# Altium schematic sheet MR26_GSS_0.SchDoc
size 363 x 297 mm; Origin: Eagle; OriginPath: C:\Users\David Nguyen\Downloads\eagle\eagle\MR26_GSS.sch; OriginSheet: 1; OriginDescription: 02 Power input, protection & 5V0
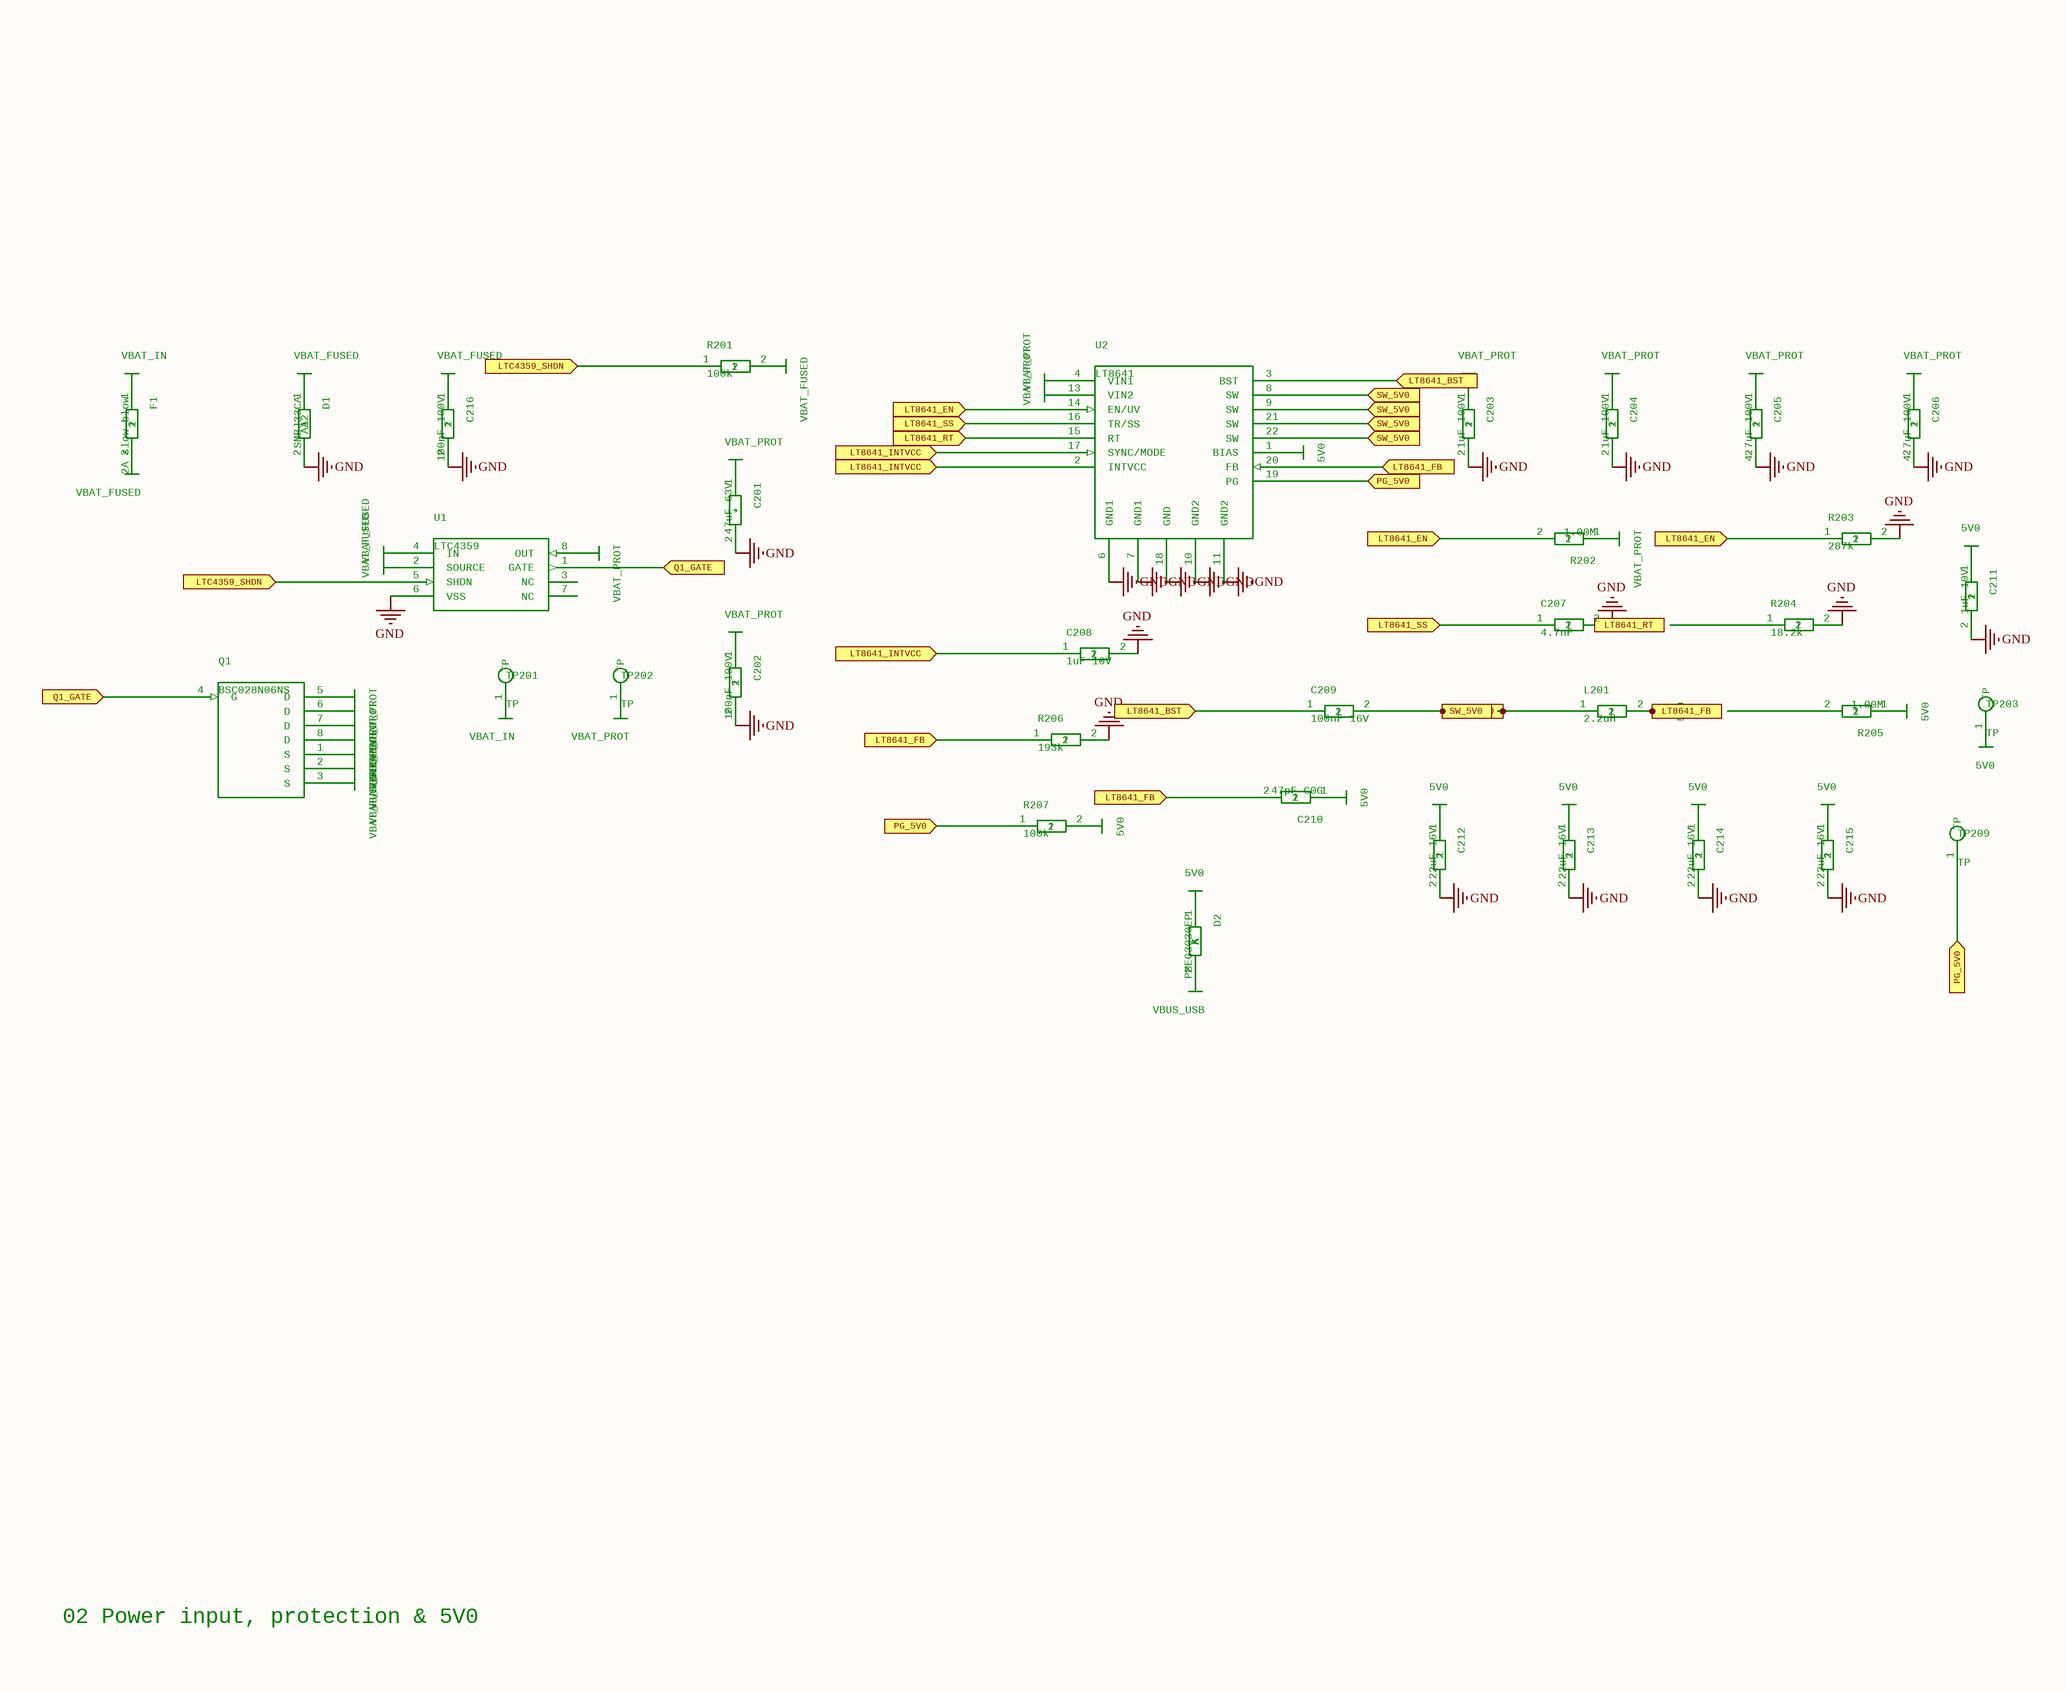
[diagram p0: MR26_GSS_0.SchDoc]

## Parts
C201  47uF 63V  [C_CP_Elec_8x10]
C202  100nF 100V  [C_0603]
C203  1uF 100V  [C_0805]
C204  1uF 100V  [C_0805]
C205  4.7uF 100V  [C_1210]
C206  4.7uF 100V  [C_1210]
C207  4.7nF  [C_0402]
C208  1uF 10V  [C_0402]
C209  100nF 16V  [C_0402]
C210  47pF C0G  [C_0402]
C211  1uF 10V  [C_0402]
C212  22uF 16V  [C_1210]
C213  22uF 16V  [C_1210]
C214  22uF 16V  [C_1210]
C215  22uF 16V  [C_1210]
C216  100nF 100V  [C_0603]
D1  SMBJ33CA  [D_SMB]
D2  PMEG3030EP  [D_SOD-128]
F1  2A slow-blow  [Fuse_Nano2_452]
L201  2.2uH  [L_XEL4030]
PWR0001  VBAT_IN
PWR0002  VBAT_FUSED
PWR0003  VBAT_FUSED
PWR0005  VBAT_FUSED
PWR0007  VBAT_FUSED
PWR0008  VBAT_FUSED
PWR0010  VBAT_PROT
PWR0011  VBAT_FUSED
PWR0012  VBAT_PROT
PWR0013  VBAT_PROT
PWR0014  VBAT_PROT
PWR0015  VBAT_PROT
PWR0016  VBAT_FUSED
PWR0017  VBAT_FUSED
PWR0018  VBAT_FUSED
PWR0019  VBAT_PROT
PWR0021  VBAT_PROT
PWR0023  VBAT_IN
PWR0024  VBAT_PROT
PWR0025  VBAT_PROT
PWR0026  VBAT_PROT
PWR0027  5V0
PWR0033  VBAT_PROT
PWR0035  VBAT_PROT
PWR0037  VBAT_PROT
PWR0039  VBAT_PROT
PWR0041  VBAT_PROT
PWR0046  5V0
PWR0047  5V0
PWR0049  5V0
PWR0050  5V0
PWR0052  5V0
PWR0054  5V0
PWR0056  5V0
PWR0058  5V0
PWR0060  5V0
PWR0061  5V0
PWR0062  VBUS_USB
PWR0063  5V0
Q1  BSC028N06NS  [PG-TDSON-8]
R201  100k  [R_0402]
R202  1.00M  [R_0402]
R203  287k  [R_0402]
R204  18.2k  [R_0402]
R205  1.00M  [R_0402]
R206  193k  [R_0402]
R207  100k  [R_0402]
TP201  TP  [TP_1.0mm]
TP202  TP  [TP_1.0mm]
TP203  TP  [TP_1.0mm]
TP209  TP  [TP_1.0mm]
U1  LTC4359  [MSOP-8]
U2  LT8641  [QFN-18_3x4_UDC]

## Ports
LT8641_BST (in), LT8641_EN (in), LT8641_FB (in), LT8641_INTVCC (in), LT8641_RT (in), LT8641_SS (in), LTC4359_SHDN (in), PG_5V0 (in), Q1_GATE (in), SW_5V0 (in)

## Nets
GND: C201.2(-) C202.2 C203.2 C204.2 C205.2 C206.2 C207.2 C208.2 C211.2 C212.2 C213.2 C214.2 C215.2 C216.2 D1.2(A2) R203.2 R204.2 R206.2 U1.6(VSS) U2.6(GND1) U2.7(GND1) U2.10(GND2) U2.11(GND2) U2.18(GND)
LT8641_BST: C209.1 U2.3(BST) ; port LT8641_BST
LT8641_EN: R202.2 R203.1 U2.14(EN/UV) ; port LT8641_EN
LT8641_FB: C210.2 L201.2 PWR0046.?1(5V0) R206.1 U2.20(FB) ; port LT8641_FB
LT8641_INTVCC: C208.1 U2.2(INTVCC) U2.17(SYNC/MODE) ; port LT8641_INTVCC
LT8641_RT: U2.15(RT) ; port LT8641_RT
LT8641_SS: C207.1 U2.16(TR/SS) ; port LT8641_SS
LTC4359_SHDN: R201.1 U1.5(SHDN) ; port LTC4359_SHDN
PG_5V0: R207.1 TP209.1(TP) U2.19(PG) ; port PG_5V0
Q1_GATE: Q1.4(G) U1.1(GATE) ; port Q1_GATE
SW_5V0: C209.2 L201.1 U2.8(SW) U2.9(SW) U2.21(SW) U2.22(SW) ; port SW_5V0
NetC201_1: C201.1(+) PWR0019.?1(VBAT_PROT)
NetC202_1: C202.1 PWR0021.?1(VBAT_PROT)
NetC203_1: C203.1 PWR0033.?1(VBAT_PROT)
NetC204_1: C204.1 PWR0035.?1(VBAT_PROT)
NetC205_1: C205.1 PWR0037.?1(VBAT_PROT)
NetC206_1: C206.1 PWR0039.?1(VBAT_PROT)
NetC210_1: C210.1 PWR0049.?1(5V0)
NetC211_1: C211.1 PWR0050.?1(5V0)
NetC212_1: C212.1 PWR0052.?1(5V0)
NetC213_1: C213.1 PWR0054.?1(5V0)
NetC214_1: C214.1 PWR0056.?1(5V0)
NetC215_1: C215.1 PWR0058.?1(5V0)
NetC216_1: C216.1 PWR0005.?1(VBAT_FUSED)
NetD1_1: D1.1(A1) PWR0003.?1(VBAT_FUSED)
NetD2_1: D2.1(K) PWR0061.?1(5V0)
NetD2_2: D2.2(A) PWR0062.?1(VBUS_USB)
NetF1_1: F1.1 PWR0001.?1(VBAT_IN)
NetF1_2: F1.2 PWR0002.?1(VBAT_FUSED)
NetPWR0007_?1: PWR0007.?1(VBAT_FUSED) U1.4(IN)
NetPWR0008_?1: PWR0008.?1(VBAT_FUSED) U1.2(SOURCE)
NetPWR0010_?1: PWR0010.?1(VBAT_PROT) U1.8(OUT)
NetPWR0011_?1: PWR0011.?1(VBAT_FUSED) R201.2
NetPWR0012_?1: PWR0012.?1(VBAT_PROT) Q1.5(D)
NetPWR0013_?1: PWR0013.?1(VBAT_PROT) Q1.6(D)
NetPWR0014_?1: PWR0014.?1(VBAT_PROT) Q1.7(D)
NetPWR0015_?1: PWR0015.?1(VBAT_PROT) Q1.8(D)
NetPWR0016_?1: PWR0016.?1(VBAT_FUSED) Q1.1(S)
NetPWR0017_?1: PWR0017.?1(VBAT_FUSED) Q1.2(S)
NetPWR0018_?1: PWR0018.?1(VBAT_FUSED) Q1.3(S)
NetPWR0023_?1: PWR0023.?1(VBAT_IN) TP201.1(TP)
NetPWR0024_?1: PWR0024.?1(VBAT_PROT) TP202.1(TP)
NetPWR0025_?1: PWR0025.?1(VBAT_PROT) U2.4(VIN1)
NetPWR0026_?1: PWR0026.?1(VBAT_PROT) U2.13(VIN2)
NetPWR0027_?1: PWR0027.?1(5V0) U2.1(BIAS)
NetPWR0041_?1: PWR0041.?1(VBAT_PROT) R202.1
NetPWR0047_?1: PWR0047.?1(5V0) R205.1
NetPWR0060_?1: PWR0060.?1(5V0) R207.2
NetPWR0063_?1: PWR0063.?1(5V0) TP203.1(TP)

Not connected (* = marked no-connect by the designer): R204 1; R205 2; U1 3(NC) 7(NC)

## Notes on the sheet
- 02 Power input, protection & 5V0

## Library data of the parts
C201 = CAP_POLC_CP_Elec_8x10: MPN: Panasonic EEH-ZC1J470P; GateName_1: G$1; SymbolName_1: CAP_POL; DeviceName: C_CP_Elec_8x10; LibraryName: MR26; DeviceSetName: CAP_POL
C202 C216 = CAPC_0603: MPN: CAP 100nF 100V 0603; GateName_1: G$1; SymbolName_1: CAP; DeviceName: C_0603; LibraryName: MR26; DeviceSetName: CAP
C203 C204 = CAPC_0805: MPN: CAP 1uF 100V 0805; GateName_1: G$1; SymbolName_1: CAP; DeviceName: C_0805; LibraryName: MR26; DeviceSetName: CAP
C205 C206 = CAPC_1210: MPN: CAP 4.7uF 100V 1210; GateName_1: G$1; SymbolName_1: CAP; DeviceName: C_1210; LibraryName: MR26; DeviceSetName: CAP
C207 = CAPC_0402: MPN: CAP 4.7nF 0402; GateName_1: G$1; SymbolName_1: CAP; DeviceName: C_0402; LibraryName: MR26; DeviceSetName: CAP
C208 C211 = CAPC_0402: MPN: CAP 1uF 10V 0402; GateName_1: G$1; SymbolName_1: CAP; DeviceName: C_0402; LibraryName: MR26; DeviceSetName: CAP
C209 = CAPC_0402: MPN: CAP 100nF 16V 0402; GateName_1: G$1; SymbolName_1: CAP; DeviceName: C_0402; LibraryName: MR26; DeviceSetName: CAP
C210 = CAPC_0402: MPN: CAP 47pF C0G 0402; GateName_1: G$1; SymbolName_1: CAP; DeviceName: C_0402; LibraryName: MR26; DeviceSetName: CAP
C212-C215 = CAPC_1210: MPN: CAP 22uF 16V 1210; GateName_1: G$1; SymbolName_1: CAP; DeviceName: C_1210; LibraryName: MR26; DeviceSetName: CAP
D1 = TVS_BIDIRD_SMB: GateName_1: G$1; SymbolName_1: TVS_BIDIR; DeviceName: D_SMB; LibraryName: MR26; DeviceSetName: TVS_BIDIR; MPN: SMBJ33CA
D2 = DIODE_SCHOTTKYD_SOD-128: GateName_1: G$1; SymbolName_1: DIODE_SCHOTTKY; DeviceName: D_SOD-128; LibraryName: MR26; DeviceSetName: DIODE_SCHOTTKY; MPN: PMEG3030EP
F1 = FUSEFuse_Nano2_452: MPN: Littelfuse 0452002.MRL; GateName_1: G$1; SymbolName_1: FUSE; DeviceName: Fuse_Nano2_452; LibraryName: MR26; DeviceSetName: FUSE
L201 = INDL_XEL4030: MPN: Coilcraft XEL4030-222MEC; GateName_1: G$1; SymbolName_1: IND; DeviceName: L_XEL4030; LibraryName: MR26; DeviceSetName: IND
PWR0001 PWR0023 = PWR_VBAT_IN: GateName_1: G$1; SymbolName_1: PWR_VBAT_IN; LibraryName: MR26; DeviceSetName: PWR_VBAT_IN
PWR0002 PWR0003 PWR0005 PWR0007 PWR0008 PWR0011 PWR0016 PWR0017 PWR0018 = PWR_VBAT_FUSED: GateName_1: G$1; SymbolName_1: PWR_VBAT_FUSED; LibraryName: MR26; DeviceSetName: PWR_VBAT_FUSED
PWR0010 PWR0012 PWR0013 PWR0014 PWR0015 PWR0019 PWR0021 PWR0024 PWR0025 PWR0026 PWR0033 PWR0035 PWR0037 PWR0039 PWR0041 = PWR_VBAT_PROT: GateName_1: G$1; SymbolName_1: PWR_VBAT_PROT; LibraryName: MR26; DeviceSetName: PWR_VBAT_PROT
PWR0027 PWR0046 PWR0047 PWR0049 PWR0050 PWR0052 PWR0054 PWR0056 PWR0058 PWR0060 PWR0061 PWR0063 = PWR_5V0: GateName_1: G$1; SymbolName_1: PWR_5V0; LibraryName: MR26; DeviceSetName: PWR_5V0
PWR0062 = PWR_VBUS_USB: GateName_1: G$1; SymbolName_1: PWR_VBUS_USB; LibraryName: MR26; DeviceSetName: PWR_VBUS_USB
Q1 = NMOS_SUPERSO8PG-TDSON-8: GateName_1: G$1; SymbolName_1: NMOS_SUPERSO8; DeviceName: PG-TDSON-8; LibraryName: MR26; DeviceSetName: NMOS_SUPERSO8; MPN: BSC028N06NS
R201 R207 = RESR_0402: MPN: RES 100k 0402; GateName_1: G$1; SymbolName_1: RES; DeviceName: R_0402; LibraryName: MR26; DeviceSetName: RES
R202 R205 = RESR_0402: MPN: RES 1.00M 0402; GateName_1: G$1; SymbolName_1: RES; DeviceName: R_0402; LibraryName: MR26; DeviceSetName: RES
R203 = RESR_0402: MPN: RES 287k 0402; GateName_1: G$1; SymbolName_1: RES; DeviceName: R_0402; LibraryName: MR26; DeviceSetName: RES
R204 = RESR_0402: MPN: RES 18.2k 0402; GateName_1: G$1; SymbolName_1: RES; DeviceName: R_0402; LibraryName: MR26; DeviceSetName: RES
R206 = RESR_0402: MPN: RES 193k 0402; GateName_1: G$1; SymbolName_1: RES; DeviceName: R_0402; LibraryName: MR26; DeviceSetName: RES
TP201-TP203 TP209 = TESTPOINTTP_1.0mm: MPN: Keystone 5019 / 1.0 mm pad; GateName_1: G$1; SymbolName_1: TESTPOINT; DeviceName: TP_1.0mm; LibraryName: MR26; DeviceSetName: TESTPOINT
U1 = LTC4359_MS8MSOP-8: MPN: LTC4359HMS8#PBF; GateName_1: G$1; SymbolName_1: LTC4359_MS8; DeviceName: MSOP-8; LibraryName: MR26; DeviceSetName: LTC4359_MS8
U2 = LT8641_QFN18QFN-18_3x4_UDC: MPN: LT8641EUDC#PBF; GateName_1: G$1; SymbolName_1: LT8641_QFN18; DeviceName: QFN-18_3x4_UDC; LibraryName: MR26; DeviceSetName: LT8641_QFN18